# Altium schematic sheet 17. SOC MCU & MAIN GEN IO, OSC.SchDoc: SOC - MCU GENERAL & MAIN GENERAL (part 2 of 2)
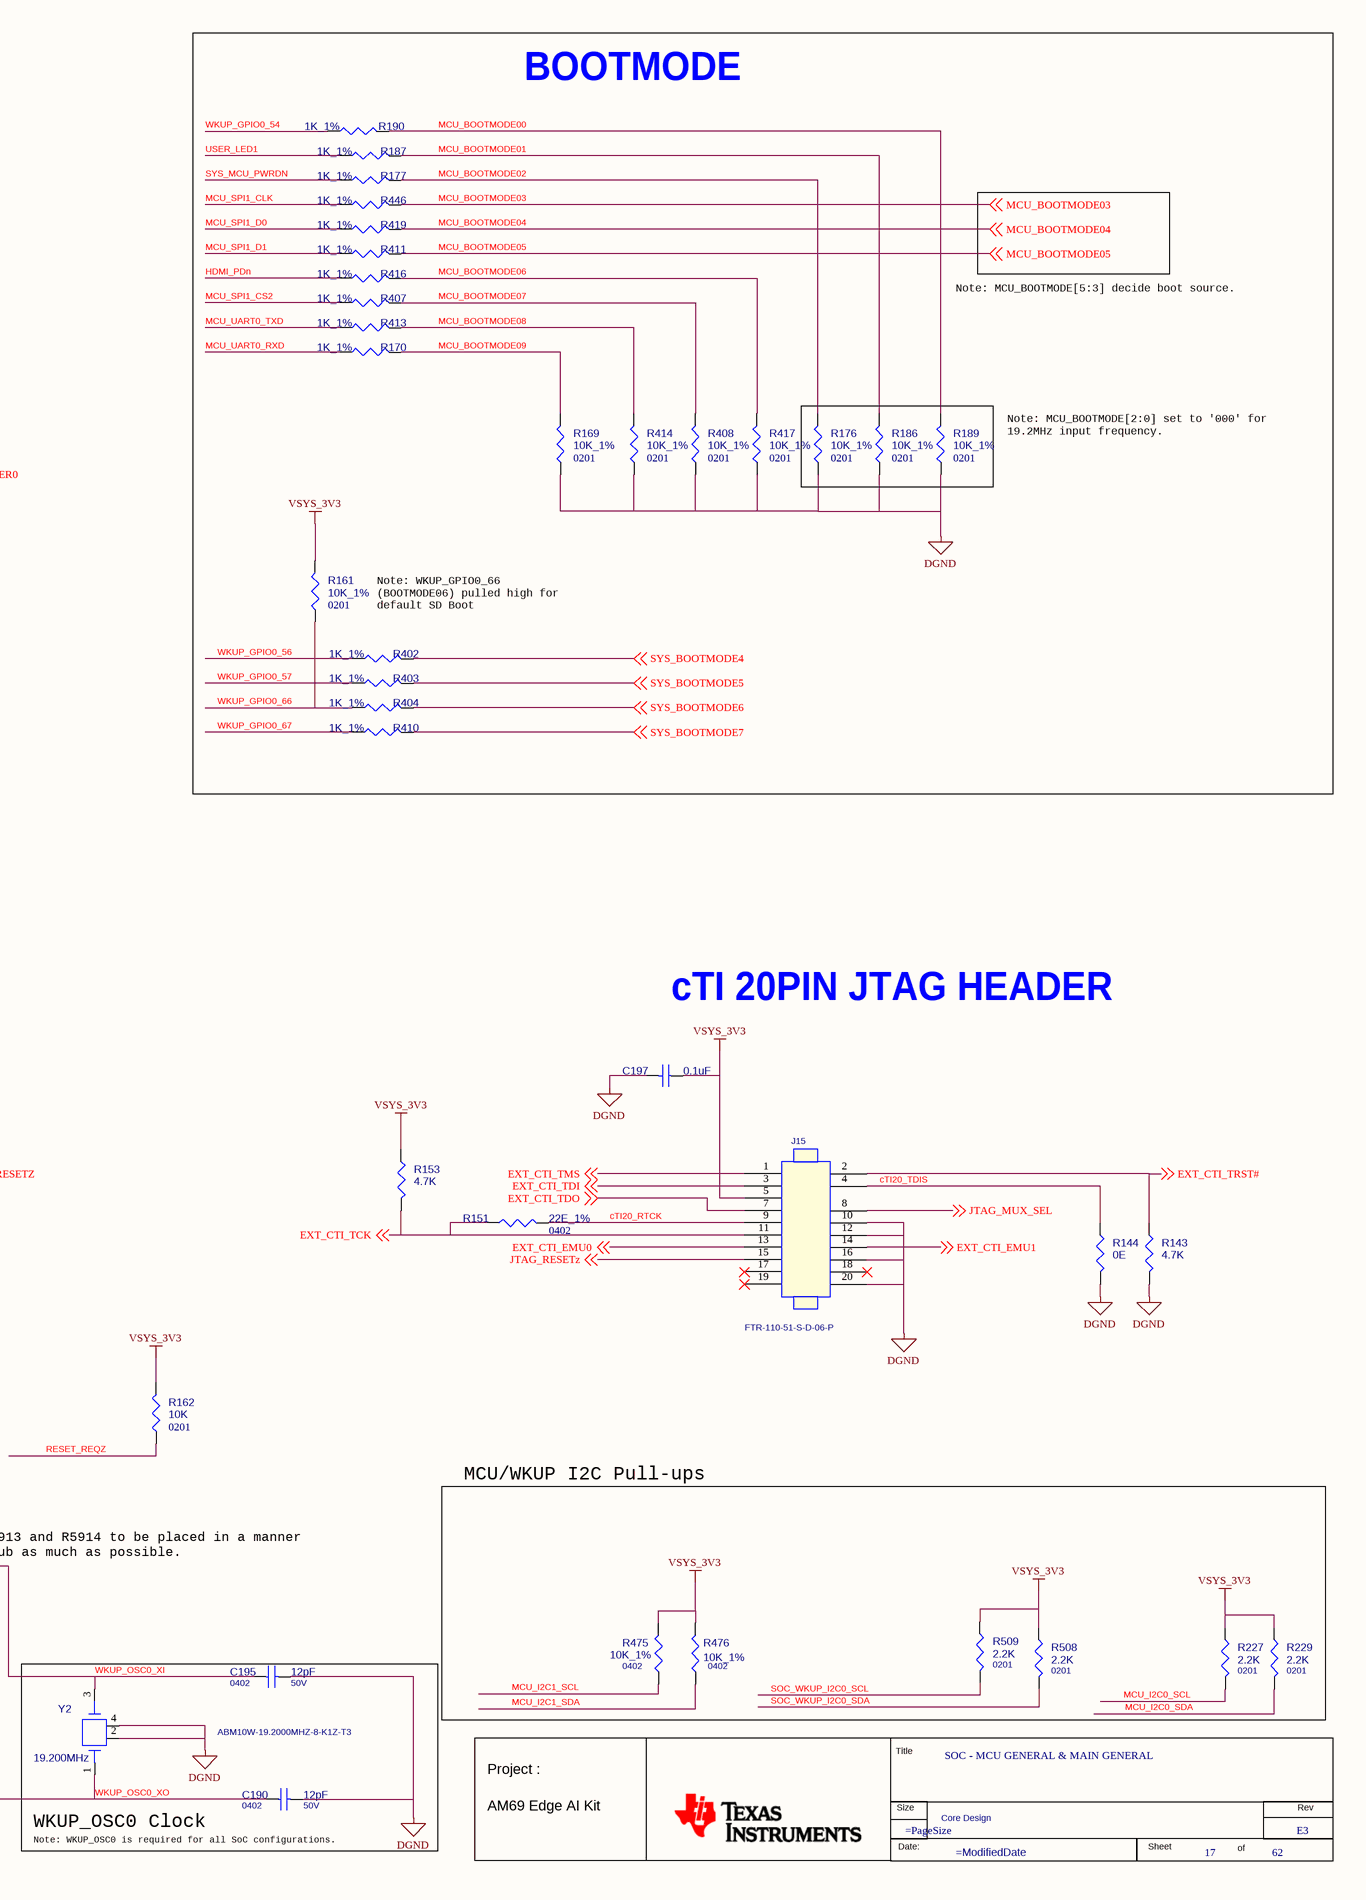
[diagram p2: 17. SOC MCU & MAIN GEN IO, OSC.SchDoc, right]

## Library data of the parts
* = MISTRAL_TITLEBLK_CSIZE_1: Issue: 1.0; Project: PROC154E2(001)_SK_AM69; Name: PROC154E2 001 SK AM69; Page Create Date: March  8, 1995; Page Size: =PageSize; Page Modify Date: =ModifiedDate; Schematic Page Count: 62; Schematic Page Number: 17
C190 = CAP_Dup1: CAP CERAMIC 12pF 50V 5% C0G(NP0) 0402; Part Reference: C190; Mistral Part No: 120015110024-R; Mfr_name: AVX CORPORATION; Mfr_part_number: 04025A120JAT2A; Part_type: CAPACITORS\CERAMIC; Direct Alternate_mfr_name: SAMSUNG; Direct Alternate_mfr_part_number: CL05C120JB5NNNC; Automotive Alternate_mfr_name: TDK; Automotive Alternate_mfr_part_number: CGA2B2C0G1H120J050BA; Project: EPDA_CORE; Customs_HS_Code: 85322990; Custom_Duty: 15%; Wattage: NA; Value: 12pF; Tolerance: 5%; Distributor_name: DIGIKEY; Distributor_part_number: 478-1071-1-ND; Library Ref: CAP; Height: 0.56MM; Datasheet: Y:\MIS_DATABASE\DATASHEETS\CAPACITORS\AVX_MLC.PDF; Crtd /date: MAZHAR/040505; Chkd/date: SHREESHAIL/281105; Footprint Ref: CAP0402_0-75; Weight: 0.65mg; Temperature: -55°C+125°C; MECHANICAL 3D STEP FILE: CAP0402_0-75; Library Path: Y:\MIS_DATABASE\Library\ALTIUM_TOOL\SCHEMATICS_PARTS\MS_DISCRETE_Library.schlib; Footprint Path: Y:\MIS_DATABASE\Library\ALTIUM_TOOL\PCB_FOOTPRINTS\Altium_Footprint_Lib.PcbLib; Manufacturer: AVX CORPORATION; PCB Footprint: CAP0402_0-75
C195 = CAP_Dup1: CAP CERAMIC 12pF 50V 5% C0G(NP0) 0402; Part Reference: C195; Automotive Alternate_mfr_part_number: CGA2B2C0G1H120J050BA; Automotive Alternate_mfr_name: TDK; Direct Alternate_mfr_part_number: CL05C120JB5NNNC; Direct Alternate_mfr_name: SAMSUNG; Mistral Part No: 120015110024-R; Mfr_name: AVX CORPORATION; Mfr_part_number: 04025A120JAT2A; Part_type: CAPACITORS\CERAMIC; Wattage: NA; Project: EPDA_CORE; Customs_HS_Code: 85322990; Custom_Duty: 15%; Value: 12pF; PCB Footprint: CAP0402_0-75; Footprint Path: Y:\MIS_DATABASE\Library\ALTIUM_TOOL\PCB_FOOTPRINTS\Altium_Footprint_Lib.PcbLib; Library Path: Y:\MIS_DATABASE\Library\ALTIUM_TOOL\SCHEMATICS_PARTS\MS_DISCRETE_Library.schlib; MECHANICAL 3D STEP FILE: CAP0402_0-75; Temperature: -55°C+125°C; Weight: 0.65mg; Footprint Ref: CAP0402_0-75; Tolerance: 5%; Distributor_name: DIGIKEY; Distributor_part_number: 478-1071-1-ND; Library Ref: CAP; Height: 0.56MM; Datasheet: Y:\MIS_DATABASE\DATASHEETS\CAPACITORS\AVX_MLC.PDF; Crtd /date: MAZHAR/040505; Chkd/date: SHREESHAIL/281105; Manufacturer: AVX CORPORATION
C197 = CAP_Dup1: CAP CERAMIC 0.1uF 16V 10% X7S AUTO 0201; Part Reference: C197; Part_type: CAPACITORS\CERAMIC; Mfr_part_number: GRT033C71C104KE01D; Mfr_name: MURATA; Mistral Part No: 120021030007-R; Custom_Duty: 15%; Customs_HS_Code: 85322990; Wattage: NA; Project: J7ES_SK_BRD; Value: 0.1uF; MECHANICAL 3D STEP FILE: CAP0201_0-5; Chkd/date: MANIRAJA/110321; Crtd /date: ALVY/110321; Datasheet: Y:\MIS_DATABASE\DATASHEETS\CAPACITORS\GRT033C71C104KE01.PDF; Temperature: -55°C+125°C; Weight: 330mg; Height: 0.33MM; Distributor_part_number: 490-GRT033C71C104KE01DTR-ND; Distributor_name: DIGIKEY; Package: 0201; Voltage: 16V; Tolerance: 10%; PCB Footprint: CAP0201_0-5
C205 = CAP_Dup1: CAP CERAMIC 12pF 50V 5% C0G(NP0) 0402; Part Reference: C205; Automotive Alternate_mfr_part_number: CGA2B2C0G1H120J050BA; Automotive Alternate_mfr_name: TDK; Direct Alternate_mfr_part_number: CL05C120JB5NNNC; Direct Alternate_mfr_name: SAMSUNG; Part_type: CAPACITORS\CERAMIC; Mfr_part_number: 04025A120JAT2A; Mfr_name: AVX CORPORATION; Mistral Part No: 120015110024-R; Wattage: NA; Custom_Duty: 15%; Customs_HS_Code: 85322990; Project: EPDA_CORE; Value: 12pF; Footprint Path: Y:\MIS_DATABASE\Library\ALTIUM_TOOL\PCB_FOOTPRINTS\Altium_Footprint_Lib.PcbLib; Library Path: Y:\MIS_DATABASE\Library\ALTIUM_TOOL\SCHEMATICS_PARTS\MS_DISCRETE_Library.schlib; MECHANICAL 3D STEP FILE: CAP0402_0-75; Temperature: -55°C+125°C; Weight: 0.65mg; Footprint Ref: CAP0402_0-75; Chkd/date: SHREESHAIL/281105; Crtd /date: MAZHAR/040505; Datasheet: Y:\MIS_DATABASE\DATASHEETS\CAPACITORS\AVX_MLC.PDF; Height: 0.56MM; Library Ref: CAP; Distributor_part_number: 478-1071-1-ND; Distributor_name: DIGIKEY; Tolerance: 5%; Manufacturer: AVX CORPORATION; PCB Footprint: CAP0402_0-75
C209 = CAP_Dup1: CAP CERAMIC 12pF 50V 5% C0G(NP0) 0402; Part Reference: C209; Mistral Part No: 120015110024-R; Mfr_name: AVX CORPORATION; Mfr_part_number: 04025A120JAT2A; Part_type: CAPACITORS\CERAMIC; Direct Alternate_mfr_name: SAMSUNG; Direct Alternate_mfr_part_number: CL05C120JB5NNNC; Automotive Alternate_mfr_name: TDK; Automotive Alternate_mfr_part_number: CGA2B2C0G1H120J050BA; Project: EPDA_CORE; Customs_HS_Code: 85322990; Custom_Duty: 15%; Wattage: NA; Value: 12pF; PCB Footprint: CAP0402_0-75; Tolerance: 5%; Distributor_name: DIGIKEY; Distributor_part_number: 478-1071-1-ND; Library Ref: CAP; Height: 0.56MM; Datasheet: Y:\MIS_DATABASE\DATASHEETS\CAPACITORS\AVX_MLC.PDF; Crtd /date: MAZHAR/040505; Chkd/date: SHREESHAIL/281105; Footprint Ref: CAP0402_0-75; Weight: 0.65mg; Temperature: -55°C+125°C; MECHANICAL 3D STEP FILE: CAP0402_0-75; Library Path: Y:\MIS_DATABASE\Library\ALTIUM_TOOL\SCHEMATICS_PARTS\MS_DISCRETE_Library.schlib; Footprint Path: Y:\MIS_DATABASE\Library\ALTIUM_TOOL\PCB_FOOTPRINTS\Altium_Footprint_Lib.PcbLib; Manufacturer: AVX CORPORATION
J15 = HEADER_10X2_FTR-06: CON HDR 2X10 1.27MM PITCH ST SMD; Part Reference: J15; Mistral Part No: 150019010009-R; Mfr_name: SAMTEC; Part_type: CONNECTOR\HEADERS; Project: TI_J7ES_EVM_JTAG; Tolerance: NA; Customs_HS_Code: 85369090; Custom_Duty: 24%; Value: HDR_2X10; Voltage: NA; Wattage: NA; Package: SMD; Distributor_name: DIGIKEY; Distributor_part_number: FTR-110-51-S-D-06-P-ND; Library Ref: HEADER_10X2_FTR-06; Footprint Ref: HDR_2X10_FTR-110-51-D-06_S_S_8-7; Height: 8.67MM; Weight: NA; Temperature: -55°C+125°C; Datasheet: Y:\MIS_DATABASE\DATASHEETS\CONNECTORS\FTR-D-SER.PDF; Crtd /date: MANIRAJA/180119; Chkd/date: MANIRAJA/180119; MECHANICAL 3D STEP FILE: HDR_2X10_FTR-110-51-D-06_S_S_8-7; Library Path: Y:\MIS_DATABASE\Library\ALTIUM_TOOL\SCHEMATICS_PARTS\MS_CONNECTOR_Library.schlib; Footprint Path: Y:\MIS_DATABASE\Library\ALTIUM_TOOL\PCB_FOOTPRINTS\Altium_Footprint_Lib.PcbLib; PCB Footprint: HDR_2X10_FTR-110-51-D-06_S_S_8-7
R143 = RESISTOR_Dup2: RES 4.7K 1/20W 5% 0201; Part Reference: R143; Part_type: RESISTORS\FIXED; Mfr_part_number: ERJ-1GNJ472C; Mfr_name: PANASONIC-ECG; Mistral Part No: 110010070061-R; Custom_Duty: 15%; Customs_HS_Code: 85332119; Voltage: NA; Project: CUSTOM DCA1000; Value: 4.7K; Footprint Path: Y:\MIS_DATABASE\Library\ALTIUM_TOOL\PCB_FOOTPRINTS\Altium_Footprint_Lib.PcbLib; Library Path: Y:\MIS_DATABASE\Library\ALTIUM_TOOL\SCHEMATICS_PARTS\MS_DISCRETE_Library.schlib; MECHANICAL 3D STEP FILE: RES0201_0-5; Chkd/date: MANIRAJA/170420; Crtd /date: ALVY/170420; Datasheet: Y:\MIS_DATABASE\DATASHEETS\RESISTORS\PAN-ERJSER_NOV17.PDF; Temperature: -55°C+125°C; Weight: 0.15mg; Height: 0.26MM; Footprint Ref: RES0201_0-5; Library Ref: RESISTOR; Distributor_part_number: P4.7AECT-ND; Distributor_name: DIGIKEY; Package: 0201; Wattage: 1/20W; Tolerance: 5%; PCB Footprint: RES0201_0-5
R144 = RESISTOR_Dup2: RES 0E 1/10W JUMPER 0402; Part Reference: R144; Mistral Part No: 110018030052-R; Mfr_name: PANASONIC-ECG; Mfr_part_number: ERJ-2GE0R00X; Part_type: RESISTORS\FIXED; Project: AEGIS POM; Tolerance: NA; Customs_HS_Code: 85332119; Custom_Duty: 15%; Value: 0E; MECHANICAL 3D STEP FILE: RES0402_0-5; Voltage: NA; Wattage: 1/10W; Package: 0402; Distributor_name: DIGIKEY; Distributor_part_number: P0.0JCT-ND; Height: 0.40MM; Weight: 0.8mg; Temperature: -55°C+155°C; Datasheet: Y:\MIS_DATABASE\DATASHEETS\RESISTORS\PAN-ERJSER_NOV17.PDF; Crtd /date: NAVEED/201014; Chkd/date: VASANTHA/061216; Library Ref: RESISTOR; Footprint Ref: RES0402_0-5; Library Path: Y:\MIS_DATABASE\Library\ALTIUM_TOOL\SCHEMATICS_PARTS\MS_DISCRETE_Library.schlib; Footprint Path: Y:\MIS_DATABASE\Library\ALTIUM_TOOL\PCB_FOOTPRINTS\Altium_Footprint_Lib.PcbLib; PCB Footprint: RES0402_0-5
R151 = RESISTOR_Dup2: RES 22E 1/16W 1% 0402; Part Reference: R151; Mistral Part No: 110009090004-R; Mfr_name: YAGEO AMERICA; Mfr_part_number: RC0402FR-0722RL; Part_type: RESISTORS\FIXED; Cust_part_number: 4700-80047E; Project: VMEFMCD; Voltage: NA; Customs_HS_Code: 85332119; Custom_Duty: 15%; Value: 22E_1%; Footprint Path: Y:\MIS_DATABASE\Library\ALTIUM_TOOL\PCB_FOOTPRINTS\Altium_Footprint_Lib.PcbLib; Library Path: Y:\MIS_DATABASE\Library\ALTIUM_TOOL\SCHEMATICS_PARTS\MS_DISCRETE_Library.schlib; MECHANICAL 3D STEP FILE: RES0402_0-5; Footprint Ref: RES0402_0-5; Tolerance: 1%; Wattage: 1/16W; Distributor_name: DIGIKEY; Distributor_part_number: 311-22.0LRCT-ND; Library Ref: RESISTOR; Height: 0.40MM; Weight: 0.65mg; Temperature: -55°C+155°C; Datasheet: Y:\MIS_DATABASE\DATASHEETS\RESISTORS\RCXXXXL-SER_MAR18.PDF; Crtd /date: MAZHAR/090909; Chkd/date: SUHAS/290910; PCB Footprint: RES0402_0-5
R153 = RESISTOR_Dup2: RES 4.7K 1/20W 5% 0201; Part Reference: R153; Mistral Part No: 110010070061-R; Mfr_name: PANASONIC-ECG; Mfr_part_number: ERJ-1GNJ472C; Part_type: RESISTORS\FIXED; Project: CUSTOM DCA1000; Voltage: NA; Customs_HS_Code: 85332119; Custom_Duty: 15%; Value: 4.7K; Tolerance: 5%; Wattage: 1/20W; Package: 0201; Distributor_name: DIGIKEY; Distributor_part_number: P4.7AECT-ND; Library Ref: RESISTOR; Footprint Ref: RES0201_0-5; Height: 0.26MM; Weight: 0.15mg; Temperature: -55°C+125°C; Datasheet: Y:\MIS_DATABASE\DATASHEETS\RESISTORS\PAN-ERJSER_NOV17.PDF; Crtd /date: ALVY/170420; Chkd/date: MANIRAJA/170420; MECHANICAL 3D STEP FILE: RES0201_0-5; Library Path: Y:\MIS_DATABASE\Library\ALTIUM_TOOL\SCHEMATICS_PARTS\MS_DISCRETE_Library.schlib; Footprint Path: Y:\MIS_DATABASE\Library\ALTIUM_TOOL\PCB_FOOTPRINTS\Altium_Footprint_Lib.PcbLib; PCB Footprint: RES0201_0-5
R155 = RESISTOR_Dup2: RES 0E 1/10W JUMPER 0402; Part Reference: R155; Manufacturer: PANASONIC-ECG; Part_type: RESISTORS\FIXED; Mfr_part_number: ERJ-2GE0R00X; Mistral Part No: 110018030052-R; IBISSP_MODLES: VALUE REPEATING 2 TIME; Custom_Duty: 15%; Customs_HS_Code: 85332119; Voltage: NA; Project: AEGIS POM; Value: 0E; Footprint Path: Y:\MIS_DATABASE\Library\ALTIUM_TOOL\PCB_FOOTPRINTS\Altium_Footprint_Lib.PcbLib; MECHANICAL 3D STEP FILE: RES0402_0-5; Chkd/date: VASANTHA/061216; Crtd /date: NAVEED/201014; Datasheet: Y:\MIS_DATABASE\DATASHEETS\RESISTORS\PAN-ERJSER_NOV17.PDF; Temperature: -55°C+155°C; Weight: 0.8mg; Height: 0.40MM; Library Ref: RESISTOR; Distributor_part_number: P0.0JCT-ND; Distributor_name: DIGIKEY; Wattage: 1/10W; Tolerance: NA; Mfr_name: PANASONIC-ECG; Footprint Ref: RES0402_0-5; Library Path: Y:\MIS_DATABASE\Library\ALTIUM_TOOL\SCHEMATICS_PARTS\MS_DISCRETE_Library.schlib; PCB Footprint: RES0402_0-5
R157 = RESISTOR_Dup2: RES 0E 1/10W JUMPER 0402; Part Reference: R157; Manufacturer: PANASONIC-ECG; Part_type: RESISTORS\FIXED; Mfr_part_number: ERJ-2GE0R00X; Mistral Part No: 110018030052-R; IBISSP_MODLES: VALUE REPEATING 2 TIME; Custom_Duty: 15%; Customs_HS_Code: 85332119; Voltage: NA; Project: AEGIS POM; Value: 0E; PCB Footprint: RES0402_0-5; Footprint Path: Y:\MIS_DATABASE\Library\ALTIUM_TOOL\PCB_FOOTPRINTS\Altium_Footprint_Lib.PcbLib; MECHANICAL 3D STEP FILE: RES0402_0-5; Chkd/date: VASANTHA/061216; Crtd /date: NAVEED/201014; Datasheet: Y:\MIS_DATABASE\DATASHEETS\RESISTORS\PAN-ERJSER_NOV17.PDF; Temperature: -55°C+155°C; Weight: 0.8mg; Height: 0.40MM; Library Ref: RESISTOR; Distributor_part_number: P0.0JCT-ND; Distributor_name: DIGIKEY; Wattage: 1/10W; Tolerance: NA; Mfr_name: PANASONIC-ECG; Footprint Ref: RES0402_0-5; Library Path: Y:\MIS_DATABASE\Library\ALTIUM_TOOL\SCHEMATICS_PARTS\MS_DISCRETE_Library.schlib
R161 = RESISTOR_Dup2: RES 10K 1/20W 1% 0201; Part Reference: R161; Manufacturer: SAMSUNG; Part_type: RESISTORS\FIXED; Mfr_part_number: RC0603F103CS; Mistral Part No: 110011040018-R; Custom_Duty: 15%; Customs_HS_Code: 85332119; Voltage: NA; Project: BRUKER_SD820_COMMONDO; Value: 10K_1%; Footprint Path: Y:\MIS_DATABASE\Library\ALTIUM_TOOL\PCB_FOOTPRINTS\Altium_Footprint_Lib.PcbLib; Library Path: Y:\MIS_DATABASE\Library\ALTIUM_TOOL\SCHEMATICS_PARTS\MS_DISCRETE_Library.schlib; Footprint Ref: RES0201_0-5; Library Ref: RESISTOR; MECHANICAL 3D STEP FILE: RES0201_0-5; Chkd/date: MANIRAJA/080519; Crtd /date: ALVY/080519; Datasheet: Y:\MIS_DATABASE\DATASHEETS\RESISTORS\SAMSUNG_RC-SER.PDF; Temperature: -55°C+125°C; Weight: 0.15mg; Height: 0.26MM; Distributor_part_number: 1276-3670-1-ND; Distributor_name: DIGIKEY; Wattage: 1/20W; Tolerance: 1%; Mfr_name: SAMSUNG; PCB Footprint: RES0201_0-5
R162 = RESISTOR_Dup2: RES 10K 1/20W 5% 0201; Part Reference: R162; Part_type: RESISTORS\FIXED; Mfr_part_number: RC0201JR-0710KL; Mfr_name: YAGEO AMERICA; Mistral Part No: 110010070051-R; Custom_Duty: 15%; Customs_HS_Code: 85332119; Voltage: NA; Project: GOLDEN-I LITE; Value: 10K; Footprint Path: Y:\MIS_DATABASE\Library\ALTIUM_TOOL\PCB_FOOTPRINTS\Altium_Footprint_Lib.PcbLib; Library Path: Y:\MIS_DATABASE\Library\ALTIUM_TOOL\SCHEMATICS_PARTS\MS_DISCRETE_Library.schlib; MECHANICAL 3D STEP FILE: RES0201_0-5; Footprint Ref: RES0201_0-5; Library Ref: RESISTOR; Chkd/date: MANIRAJA/050517; Crtd /date: MANIRAJA/050517; Datasheet: Y:\MIS_DATABASE\DATASHEETS\RESISTORS\RCXXXXL-SER_MAR18.PDF; Temperature: -55°C+125°C; Weight: 0.17mg; Height: 0.26MM; Distributor_part_number: 311-10KNCT-ND; Distributor_name: DIGIKEY; Wattage: 1/20W; Tolerance: 5%; PCB Footprint: RES0201_0-5
R169 = RESISTOR_Dup2: RES 10K 1/20W 1% 0201; Part Reference: R169; Manufacturer: SAMSUNG; Part_type: RESISTORS\FIXED; Mfr_part_number: RC0603F103CS; Mistral Part No: 110011040018-R; Custom_Duty: 15%; Customs_HS_Code: 85332119; Voltage: NA; Project: BRUKER_SD820_COMMONDO; Value: 10K_1%; Footprint Path: Y:\MIS_DATABASE\Library\ALTIUM_TOOL\PCB_FOOTPRINTS\Altium_Footprint_Lib.PcbLib; Library Path: Y:\MIS_DATABASE\Library\ALTIUM_TOOL\SCHEMATICS_PARTS\MS_DISCRETE_Library.schlib; Footprint Ref: RES0201_0-5; Library Ref: RESISTOR; MECHANICAL 3D STEP FILE: RES0201_0-5; Chkd/date: MANIRAJA/080519; Crtd /date: ALVY/080519; Datasheet: Y:\MIS_DATABASE\DATASHEETS\RESISTORS\SAMSUNG_RC-SER.PDF; Temperature: -55°C+125°C; Weight: 0.15mg; Height: 0.26MM; Distributor_part_number: 1276-3670-1-ND; Distributor_name: DIGIKEY; Wattage: 1/20W; Tolerance: 1%; Mfr_name: SAMSUNG; PCB Footprint: RES0201_0-5
R170 = RESISTOR_Dup1: RES 1K 1/20W 1% 0201; Part Reference: R170; Manufacturer: KOA SPEER; Mistral Part No: 110015080014-R; Mfr_part_number: RK73H1HTTC1001F; Part_type: RESISTORS\FIXED; Voltage: NA; Project: HMC; Customs_HS_Code: 85332119; Custom_Duty: 15%; Value: 1K_1%; Footprint Path: Y:\MIS_DATABASE\Library\ALTIUM_TOOL\PCB_FOOTPRINTS\Altium_Footprint_Lib.PcbLib; Library Path: Y:\MIS_DATABASE\Library\ALTIUM_TOOL\SCHEMATICS_PARTS\MS_DISCRETE_Library.schlib; MECHANICAL 3D STEP FILE: RES0201_0-5; Footprint Ref: RES0201_0-5; Mfr_name: KOA SPEER; Tolerance: 1%; Wattage: 1/20W; Package: 0201; Distributor_name: MOUSER; Distributor_part_number: 660-RK73H1HTTC1001F; Height: 0.26MM; Weight: 0.17mg; Temperature: -55°C+155°C; Datasheet: Y:\MIS_DATABASE\DATASHEETS\RESISTORS\RK73H-SER.PDF; Crtd /date: MAZHAR/100511; Chkd/date: RAGESH/120511; Library Ref: RESISTOR; PCB Footprint: RES0201_0-5
R175 = RESISTOR_Dup2: RES 2.2K 1/20W 5% 0201; Part Reference: R175; Manufacturer: YAGEO AMERICA; Mistral Part No: 110009030427-R; Mfr_part_number: RC0201JR-072K2L; Part_type: RESISTORS\FIXED; Project: GOLDEN-I LITE; Voltage: NA; Customs_HS_Code: 85332119; Custom_Duty: 15%; Value: 2.2K; Footprint Path: Y:\MIS_DATABASE\Library\ALTIUM_TOOL\PCB_FOOTPRINTS\Altium_Footprint_Lib.PcbLib; Library Path: Y:\MIS_DATABASE\Library\ALTIUM_TOOL\SCHEMATICS_PARTS\MS_DISCRETE_Library.schlib; Footprint Ref: RES0201_0-5; Mfr_name: YAGEO AMERICA; Tolerance: 5%; Wattage: 1/20W; Distributor_name: DIGIKEY; Distributor_part_number: 311-2.2KNCT-ND; Library Ref: RESISTOR; Height: 0.26MM; Weight: 0.17mg; Temperature: -55°C+125°C; Datasheet: Y:\MIS_DATABASE\DATASHEETS\RESISTORS\RCXXXXL-SER_MAR18.PDF; Crtd /date: MANIRAJA/050517; Chkd/date: MANIRAJA/050517; MECHANICAL 3D STEP FILE: RES0201_0-5; PCB Footprint: RES0201_0-5
R176 = RESISTOR_Dup2: RES 10K 1/20W 1% 0201; Part Reference: R176; Manufacturer: SAMSUNG; Part_type: RESISTORS\FIXED; Mfr_part_number: RC0603F103CS; Mistral Part No: 110011040018-R; Custom_Duty: 15%; Customs_HS_Code: 85332119; Voltage: NA; Project: BRUKER_SD820_COMMONDO; Value: 10K_1%; Footprint Path: Y:\MIS_DATABASE\Library\ALTIUM_TOOL\PCB_FOOTPRINTS\Altium_Footprint_Lib.PcbLib; Library Path: Y:\MIS_DATABASE\Library\ALTIUM_TOOL\SCHEMATICS_PARTS\MS_DISCRETE_Library.schlib; Footprint Ref: RES0201_0-5; Library Ref: RESISTOR; MECHANICAL 3D STEP FILE: RES0201_0-5; Chkd/date: MANIRAJA/080519; Crtd /date: ALVY/080519; Datasheet: Y:\MIS_DATABASE\DATASHEETS\RESISTORS\SAMSUNG_RC-SER.PDF; Temperature: -55°C+125°C; Weight: 0.15mg; Height: 0.26MM; Distributor_part_number: 1276-3670-1-ND; Distributor_name: DIGIKEY; Wattage: 1/20W; Tolerance: 1%; Mfr_name: SAMSUNG; PCB Footprint: RES0201_0-5
R177 = RESISTOR_Dup1: RES 1K 1/20W 1% 0201; Part Reference: R177; Part_type: RESISTORS\FIXED; Mfr_part_number: RK73H1HTTC1001F; Mfr_name: KOA SPEER; Mistral Part No: 110015080014-R; Custom_Duty: 15%; Customs_HS_Code: 85332119; Project: HMC; Voltage: NA; Value: 1K_1%; PCB Footprint: RES0201_0-5; Library Ref: RESISTOR; Chkd/date: RAGESH/120511; Crtd /date: MAZHAR/100511; Datasheet: Y:\MIS_DATABASE\DATASHEETS\RESISTORS\RK73H-SER.PDF; Temperature: -55°C+155°C; Weight: 0.17mg; Height: 0.26MM; Distributor_part_number: 660-RK73H1HTTC1001F; Distributor_name: MOUSER; Package: 0201; Wattage: 1/20W; Tolerance: 1%; Footprint Ref: RES0201_0-5; MECHANICAL 3D STEP FILE: RES0201_0-5; Library Path: Y:\MIS_DATABASE\Library\ALTIUM_TOOL\SCHEMATICS_PARTS\MS_DISCRETE_Library.schlib; Footprint Path: Y:\MIS_DATABASE\Library\ALTIUM_TOOL\PCB_FOOTPRINTS\Altium_Footprint_Lib.PcbLib; Manufacturer: KOA SPEER
R186 = RESISTOR_Dup2: RES 10K 1/20W 1% 0201; Part Reference: R186; Manufacturer: SAMSUNG; Part_type: RESISTORS\FIXED; Mfr_part_number: RC0603F103CS; Mistral Part No: 110011040018-R; Custom_Duty: 15%; Customs_HS_Code: 85332119; Voltage: NA; Project: BRUKER_SD820_COMMONDO; Value: 10K_1%; Footprint Path: Y:\MIS_DATABASE\Library\ALTIUM_TOOL\PCB_FOOTPRINTS\Altium_Footprint_Lib.PcbLib; Library Path: Y:\MIS_DATABASE\Library\ALTIUM_TOOL\SCHEMATICS_PARTS\MS_DISCRETE_Library.schlib; Footprint Ref: RES0201_0-5; Library Ref: RESISTOR; MECHANICAL 3D STEP FILE: RES0201_0-5; Chkd/date: MANIRAJA/080519; Crtd /date: ALVY/080519; Datasheet: Y:\MIS_DATABASE\DATASHEETS\RESISTORS\SAMSUNG_RC-SER.PDF; Temperature: -55°C+125°C; Weight: 0.15mg; Height: 0.26MM; Distributor_part_number: 1276-3670-1-ND; Distributor_name: DIGIKEY; Wattage: 1/20W; Tolerance: 1%; Mfr_name: SAMSUNG; PCB Footprint: RES0201_0-5
R187 = RESISTOR_Dup1: RES 1K 1/20W 1% 0201; Part Reference: R187; Manufacturer: KOA SPEER; Mistral Part No: 110015080014-R; Mfr_part_number: RK73H1HTTC1001F; Part_type: RESISTORS\FIXED; Voltage: NA; Project: HMC; Customs_HS_Code: 85332119; Custom_Duty: 15%; Value: 1K_1%; PCB Footprint: RES0201_0-5; Footprint Path: Y:\MIS_DATABASE\Library\ALTIUM_TOOL\PCB_FOOTPRINTS\Altium_Footprint_Lib.PcbLib; Library Path: Y:\MIS_DATABASE\Library\ALTIUM_TOOL\SCHEMATICS_PARTS\MS_DISCRETE_Library.schlib; MECHANICAL 3D STEP FILE: RES0201_0-5; Footprint Ref: RES0201_0-5; Mfr_name: KOA SPEER; Tolerance: 1%; Wattage: 1/20W; Package: 0201; Distributor_name: MOUSER; Distributor_part_number: 660-RK73H1HTTC1001F; Height: 0.26MM; Weight: 0.17mg; Temperature: -55°C+155°C; Datasheet: Y:\MIS_DATABASE\DATASHEETS\RESISTORS\RK73H-SER.PDF; Crtd /date: MAZHAR/100511; Chkd/date: RAGESH/120511; Library Ref: RESISTOR
R189 = RESISTOR_Dup2: RES 10K 1/20W 1% 0201; Part Reference: R189; Mistral Part No: 110011040018-R; Mfr_name: SAMSUNG; Mfr_part_number: RC0603F103CS; Part_type: RESISTORS\FIXED; Project: BRUKER_SD820_COMMONDO; Voltage: NA; Customs_HS_Code: 85332119; Custom_Duty: 15%; Value: 10K_1%; Tolerance: 1%; Wattage: 1/20W; Distributor_name: DIGIKEY; Distributor_part_number: 1276-3670-1-ND; Height: 0.26MM; Weight: 0.15mg; Temperature: -55°C+125°C; Datasheet: Y:\MIS_DATABASE\DATASHEETS\RESISTORS\SAMSUNG_RC-SER.PDF; Crtd /date: ALVY/080519; Chkd/date: MANIRAJA/080519; MECHANICAL 3D STEP FILE: RES0201_0-5; Library Ref: RESISTOR; Footprint Ref: RES0201_0-5; Library Path: Y:\MIS_DATABASE\Library\ALTIUM_TOOL\SCHEMATICS_PARTS\MS_DISCRETE_Library.schlib; Footprint Path: Y:\MIS_DATABASE\Library\ALTIUM_TOOL\PCB_FOOTPRINTS\Altium_Footprint_Lib.PcbLib; Manufacturer: SAMSUNG; PCB Footprint: RES0201_0-5
R190 = RESISTOR_Dup1: RES 1K 1/20W 1% 0201; Part Reference: R190; Manufacturer: KOA SPEER; Mistral Part No: 110015080014-R; Mfr_part_number: RK73H1HTTC1001F; Part_type: RESISTORS\FIXED; Voltage: NA; Project: HMC; Customs_HS_Code: 85332119; Custom_Duty: 15%; Value: 1K_1%; PCB Footprint: RES0201_0-5; Footprint Path: Y:\MIS_DATABASE\Library\ALTIUM_TOOL\PCB_FOOTPRINTS\Altium_Footprint_Lib.PcbLib; Library Path: Y:\MIS_DATABASE\Library\ALTIUM_TOOL\SCHEMATICS_PARTS\MS_DISCRETE_Library.schlib; MECHANICAL 3D STEP FILE: RES0201_0-5; Footprint Ref: RES0201_0-5; Mfr_name: KOA SPEER; Tolerance: 1%; Wattage: 1/20W; Package: 0201; Distributor_name: MOUSER; Distributor_part_number: 660-RK73H1HTTC1001F; Height: 0.26MM; Weight: 0.17mg; Temperature: -55°C+155°C; Datasheet: Y:\MIS_DATABASE\DATASHEETS\RESISTORS\RK73H-SER.PDF; Crtd /date: MAZHAR/100511; Chkd/date: RAGESH/120511; Library Ref: RESISTOR
R227 = RESISTOR_Dup2: RES 2.2K 1/20W 5% 0201; Part Reference: R227; Manufacturer: YAGEO AMERICA; Part_type: RESISTORS\FIXED; Mfr_part_number: RC0201JR-072K2L; Mistral Part No: 110009030427-R; Custom_Duty: 15%; Customs_HS_Code: 85332119; Voltage: NA; Project: GOLDEN-I LITE; Value: 2.2K; PCB Footprint: RES0201_0-5; MECHANICAL 3D STEP FILE: RES0201_0-5; Chkd/date: MANIRAJA/050517; Crtd /date: MANIRAJA/050517; Datasheet: Y:\MIS_DATABASE\DATASHEETS\RESISTORS\RCXXXXL-SER_MAR18.PDF; Temperature: -55°C+125°C; Weight: 0.17mg; Height: 0.26MM; Library Ref: RESISTOR; Distributor_part_number: 311-2.2KNCT-ND; Distributor_name: DIGIKEY; Wattage: 1/20W; Tolerance: 5%; Mfr_name: YAGEO AMERICA; Footprint Ref: RES0201_0-5; Library Path: Y:\MIS_DATABASE\Library\ALTIUM_TOOL\SCHEMATICS_PARTS\MS_DISCRETE_Library.schlib; Footprint Path: Y:\MIS_DATABASE\Library\ALTIUM_TOOL\PCB_FOOTPRINTS\Altium_Footprint_Lib.PcbLib
R229 = RESISTOR_Dup2: RES 2.2K 1/20W 5% 0201; Part Reference: R229; Manufacturer: YAGEO AMERICA; Part_type: RESISTORS\FIXED; Mfr_part_number: RC0201JR-072K2L; Mistral Part No: 110009030427-R; Custom_Duty: 15%; Customs_HS_Code: 85332119; Voltage: NA; Project: GOLDEN-I LITE; Value: 2.2K; PCB Footprint: RES0201_0-5; MECHANICAL 3D STEP FILE: RES0201_0-5; Chkd/date: MANIRAJA/050517; Crtd /date: MANIRAJA/050517; Datasheet: Y:\MIS_DATABASE\DATASHEETS\RESISTORS\RCXXXXL-SER_MAR18.PDF; Temperature: -55°C+125°C; Weight: 0.17mg; Height: 0.26MM; Library Ref: RESISTOR; Distributor_part_number: 311-2.2KNCT-ND; Distributor_name: DIGIKEY; Wattage: 1/20W; Tolerance: 5%; Mfr_name: YAGEO AMERICA; Footprint Ref: RES0201_0-5; Library Path: Y:\MIS_DATABASE\Library\ALTIUM_TOOL\SCHEMATICS_PARTS\MS_DISCRETE_Library.schlib; Footprint Path: Y:\MIS_DATABASE\Library\ALTIUM_TOOL\PCB_FOOTPRINTS\Altium_Footprint_Lib.PcbLib
R292 = RESISTOR_Dup2: RES 0E 1/10W JUMPER 0402; Part Reference: R292; Mistral Part No: 110018030052-R; Mfr_name: PANASONIC-ECG; Mfr_part_number: ERJ-2GE0R00X; Part_type: RESISTORS\FIXED; Project: AEGIS POM; Tolerance: NA; Customs_HS_Code: 85332119; Custom_Duty: 15%; IBISSP_MODLES: VALUE REPEATING 2 TIME; Value: 0E; Library Path: Y:\MIS_DATABASE\Library\ALTIUM_TOOL\SCHEMATICS_PARTS\MS_DISCRETE_Library.schlib; Footprint Ref: RES0402_0-5; Voltage: NA; Wattage: 1/10W; Package: 0402; Distributor_name: DIGIKEY; Distributor_part_number: P0.0JCT-ND; Library Ref: RESISTOR; Height: 0.40MM; Weight: 0.8mg; Temperature: -55°C+155°C; Datasheet: Y:\MIS_DATABASE\DATASHEETS\RESISTORS\PAN-ERJSER_NOV17.PDF; Crtd /date: NAVEED/201014; Chkd/date: VASANTHA/061216; MECHANICAL 3D STEP FILE: RES0402_0-5; Footprint Path: Y:\MIS_DATABASE\Library\ALTIUM_TOOL\PCB_FOOTPRINTS\Altium_Footprint_Lib.PcbLib; Manufacturer: PANASONIC-ECG; PCB Footprint: RES0402_0-5
R309 = RESISTOR_Dup2: RES 10K 1/16W 1% 0402; Part Reference: R309; Manufacturer: YAGEO AMERICA; Part_type: RESISTORS\FIXED; Mfr_part_number: RC0402FR-0710KL; Mistral Part No: 110015090015-R; Custom_Duty: 15%; Customs_HS_Code: 85332119; Voltage: NA; Project: VOCERA; Value: 10K_1%; Footprint Path: Y:\MIS_DATABASE\Library\ALTIUM_TOOL\PCB_FOOTPRINTS\Altium_Footprint_Lib.PcbLib; Library Path: Y:\MIS_DATABASE\Library\ALTIUM_TOOL\SCHEMATICS_PARTS\MS_DISCRETE_Library.schlib; MECHANICAL 3D STEP FILE: RES0402_0-5; Chkd/date: VASANTHA/201216; Crtd /date: GEETHA/290506; Datasheet: Y:\MIS_DATABASE\DATASHEETS\RESISTORS\RCXXXXL-SER_MAR18.PDF; Temperature: -55°C+155°C; Weight: 0.65mg; Height: 0.40MM; Library Ref: RESISTOR; Distributor_part_number: 311-10.0KLRTR-ND; Distributor_name: DIGIKEY; Package: 0402; Wattage: 1/16W; Tolerance: 1%; Mfr_name: YAGEO AMERICA; Footprint Ref: RES0402_0-5; PCB Footprint: RES0402_0-5
R401 = RESISTOR_Dup2: RES 0E 1/10W JUMPER 0402; Part Reference: R401; Mistral Part No: 110018030052-R; Mfr_name: PANASONIC-ECG; Mfr_part_number: ERJ-2GE0R00X; Part_type: RESISTORS\FIXED; Project: AEGIS POM; Tolerance: NA; Customs_HS_Code: 85332119; Custom_Duty: 15%; IBISSP_MODLES: VALUE REPEATING 2 TIME; Value: 0E; Library Path: Y:\MIS_DATABASE\Library\ALTIUM_TOOL\SCHEMATICS_PARTS\MS_DISCRETE_Library.schlib; Footprint Ref: RES0402_0-5; Voltage: NA; Wattage: 1/10W; Package: 0402; Distributor_name: DIGIKEY; Distributor_part_number: P0.0JCT-ND; Library Ref: RESISTOR; Height: 0.40MM; Weight: 0.8mg; Temperature: -55°C+155°C; Datasheet: Y:\MIS_DATABASE\DATASHEETS\RESISTORS\PAN-ERJSER_NOV17.PDF; Crtd /date: NAVEED/201014; Chkd/date: VASANTHA/061216; MECHANICAL 3D STEP FILE: RES0402_0-5; Footprint Path: Y:\MIS_DATABASE\Library\ALTIUM_TOOL\PCB_FOOTPRINTS\Altium_Footprint_Lib.PcbLib; Manufacturer: PANASONIC-ECG; PCB Footprint: RES0402_0-5
R402 = RESISTOR_Dup1: RES 1K 1/20W 1% 0201; Part Reference: R402; Manufacturer: KOA SPEER; Mistral Part No: 110015080014-R; Mfr_part_number: RK73H1HTTC1001F; Part_type: RESISTORS\FIXED; Voltage: NA; Project: HMC; Customs_HS_Code: 85332119; Custom_Duty: 15%; Value: 1K_1%; PCB Footprint: RES0201_0-5; Footprint Path: Y:\MIS_DATABASE\Library\ALTIUM_TOOL\PCB_FOOTPRINTS\Altium_Footprint_Lib.PcbLib; Library Path: Y:\MIS_DATABASE\Library\ALTIUM_TOOL\SCHEMATICS_PARTS\MS_DISCRETE_Library.schlib; MECHANICAL 3D STEP FILE: RES0201_0-5; Footprint Ref: RES0201_0-5; Mfr_name: KOA SPEER; Tolerance: 1%; Wattage: 1/20W; Package: 0201; Distributor_name: MOUSER; Distributor_part_number: 660-RK73H1HTTC1001F; Height: 0.26MM; Weight: 0.17mg; Temperature: -55°C+155°C; Datasheet: Y:\MIS_DATABASE\DATASHEETS\RESISTORS\RK73H-SER.PDF; Crtd /date: MAZHAR/100511; Chkd/date: RAGESH/120511; Library Ref: RESISTOR
R403 = RESISTOR_Dup1: RES 1K 1/20W 1% 0201; Part Reference: R403; Manufacturer: KOA SPEER; Mistral Part No: 110015080014-R; Mfr_part_number: RK73H1HTTC1001F; Part_type: RESISTORS\FIXED; Voltage: NA; Project: HMC; Customs_HS_Code: 85332119; Custom_Duty: 15%; Value: 1K_1%; PCB Footprint: RES0201_0-5; Footprint Path: Y:\MIS_DATABASE\Library\ALTIUM_TOOL\PCB_FOOTPRINTS\Altium_Footprint_Lib.PcbLib; Library Path: Y:\MIS_DATABASE\Library\ALTIUM_TOOL\SCHEMATICS_PARTS\MS_DISCRETE_Library.schlib; MECHANICAL 3D STEP FILE: RES0201_0-5; Footprint Ref: RES0201_0-5; Mfr_name: KOA SPEER; Tolerance: 1%; Wattage: 1/20W; Package: 0201; Distributor_name: MOUSER; Distributor_part_number: 660-RK73H1HTTC1001F; Height: 0.26MM; Weight: 0.17mg; Temperature: -55°C+155°C; Datasheet: Y:\MIS_DATABASE\DATASHEETS\RESISTORS\RK73H-SER.PDF; Crtd /date: MAZHAR/100511; Chkd/date: RAGESH/120511; Library Ref: RESISTOR
R404 = RESISTOR_Dup1: RES 1K 1/20W 1% 0201; Part Reference: R404; Manufacturer: KOA SPEER; Mistral Part No: 110015080014-R; Mfr_part_number: RK73H1HTTC1001F; Part_type: RESISTORS\FIXED; Voltage: NA; Project: HMC; Customs_HS_Code: 85332119; Custom_Duty: 15%; Value: 1K_1%; PCB Footprint: RES0201_0-5; Footprint Path: Y:\MIS_DATABASE\Library\ALTIUM_TOOL\PCB_FOOTPRINTS\Altium_Footprint_Lib.PcbLib; Library Path: Y:\MIS_DATABASE\Library\ALTIUM_TOOL\SCHEMATICS_PARTS\MS_DISCRETE_Library.schlib; MECHANICAL 3D STEP FILE: RES0201_0-5; Footprint Ref: RES0201_0-5; Mfr_name: KOA SPEER; Tolerance: 1%; Wattage: 1/20W; Package: 0201; Distributor_name: MOUSER; Distributor_part_number: 660-RK73H1HTTC1001F; Height: 0.26MM; Weight: 0.17mg; Temperature: -55°C+155°C; Datasheet: Y:\MIS_DATABASE\DATASHEETS\RESISTORS\RK73H-SER.PDF; Crtd /date: MAZHAR/100511; Chkd/date: RAGESH/120511; Library Ref: RESISTOR
R407 = RESISTOR_Dup1: RES 1K 1/20W 1% 0201; Part Reference: R407; Manufacturer: KOA SPEER; Mistral Part No: 110015080014-R; Mfr_part_number: RK73H1HTTC1001F; Part_type: RESISTORS\FIXED; Voltage: NA; Project: HMC; Customs_HS_Code: 85332119; Custom_Duty: 15%; Value: 1K_1%; Footprint Path: Y:\MIS_DATABASE\Library\ALTIUM_TOOL\PCB_FOOTPRINTS\Altium_Footprint_Lib.PcbLib; Library Path: Y:\MIS_DATABASE\Library\ALTIUM_TOOL\SCHEMATICS_PARTS\MS_DISCRETE_Library.schlib; MECHANICAL 3D STEP FILE: RES0201_0-5; Footprint Ref: RES0201_0-5; Mfr_name: KOA SPEER; Tolerance: 1%; Wattage: 1/20W; Package: 0201; Distributor_name: MOUSER; Distributor_part_number: 660-RK73H1HTTC1001F; Height: 0.26MM; Weight: 0.17mg; Temperature: -55°C+155°C; Datasheet: Y:\MIS_DATABASE\DATASHEETS\RESISTORS\RK73H-SER.PDF; Crtd /date: MAZHAR/100511; Chkd/date: RAGESH/120511; Library Ref: RESISTOR; PCB Footprint: RES0201_0-5
R408 = RESISTOR_Dup2: RES 10K 1/20W 1% 0201; Part Reference: R408; Manufacturer: SAMSUNG; Part_type: RESISTORS\FIXED; Mfr_part_number: RC0603F103CS; Mistral Part No: 110011040018-R; Custom_Duty: 15%; Customs_HS_Code: 85332119; Voltage: NA; Project: BRUKER_SD820_COMMONDO; Value: 10K_1%; Footprint Path: Y:\MIS_DATABASE\Library\ALTIUM_TOOL\PCB_FOOTPRINTS\Altium_Footprint_Lib.PcbLib; Library Path: Y:\MIS_DATABASE\Library\ALTIUM_TOOL\SCHEMATICS_PARTS\MS_DISCRETE_Library.schlib; Footprint Ref: RES0201_0-5; Library Ref: RESISTOR; MECHANICAL 3D STEP FILE: RES0201_0-5; Chkd/date: MANIRAJA/080519; Crtd /date: ALVY/080519; Datasheet: Y:\MIS_DATABASE\DATASHEETS\RESISTORS\SAMSUNG_RC-SER.PDF; Temperature: -55°C+125°C; Weight: 0.15mg; Height: 0.26MM; Distributor_part_number: 1276-3670-1-ND; Distributor_name: DIGIKEY; Wattage: 1/20W; Tolerance: 1%; Mfr_name: SAMSUNG; PCB Footprint: RES0201_0-5
R410 = RESISTOR_Dup1: RES 1K 1/20W 1% 0201; Part Reference: R410; Manufacturer: KOA SPEER; Mistral Part No: 110015080014-R; Mfr_part_number: RK73H1HTTC1001F; Part_type: RESISTORS\FIXED; Voltage: NA; Project: HMC; Customs_HS_Code: 85332119; Custom_Duty: 15%; Value: 1K_1%; PCB Footprint: RES0201_0-5; Footprint Path: Y:\MIS_DATABASE\Library\ALTIUM_TOOL\PCB_FOOTPRINTS\Altium_Footprint_Lib.PcbLib; Library Path: Y:\MIS_DATABASE\Library\ALTIUM_TOOL\SCHEMATICS_PARTS\MS_DISCRETE_Library.schlib; MECHANICAL 3D STEP FILE: RES0201_0-5; Footprint Ref: RES0201_0-5; Mfr_name: KOA SPEER; Tolerance: 1%; Wattage: 1/20W; Package: 0201; Distributor_name: MOUSER; Distributor_part_number: 660-RK73H1HTTC1001F; Height: 0.26MM; Weight: 0.17mg; Temperature: -55°C+155°C; Datasheet: Y:\MIS_DATABASE\DATASHEETS\RESISTORS\RK73H-SER.PDF; Crtd /date: MAZHAR/100511; Chkd/date: RAGESH/120511; Library Ref: RESISTOR
R411 = RESISTOR_Dup1: RES 1K 1/20W 1% 0201; Part Reference: R411; Part_type: RESISTORS\FIXED; Mfr_part_number: RK73H1HTTC1001F; Mfr_name: KOA SPEER; Mistral Part No: 110015080014-R; Custom_Duty: 15%; Customs_HS_Code: 85332119; Project: HMC; Voltage: NA; Value: 1K_1%; Library Ref: RESISTOR; Chkd/date: RAGESH/120511; Crtd /date: MAZHAR/100511; Datasheet: Y:\MIS_DATABASE\DATASHEETS\RESISTORS\RK73H-SER.PDF; Temperature: -55°C+155°C; Weight: 0.17mg; Height: 0.26MM; Distributor_part_number: 660-RK73H1HTTC1001F; Distributor_name: MOUSER; Package: 0201; Wattage: 1/20W; Tolerance: 1%; Footprint Ref: RES0201_0-5; MECHANICAL 3D STEP FILE: RES0201_0-5; Library Path: Y:\MIS_DATABASE\Library\ALTIUM_TOOL\SCHEMATICS_PARTS\MS_DISCRETE_Library.schlib; Footprint Path: Y:\MIS_DATABASE\Library\ALTIUM_TOOL\PCB_FOOTPRINTS\Altium_Footprint_Lib.PcbLib; Manufacturer: KOA SPEER; PCB Footprint: RES0201_0-5
R413 = RESISTOR_Dup1: RES 1K 1/20W 1% 0201; Part Reference: R413; Manufacturer: KOA SPEER; Mistral Part No: 110015080014-R; Mfr_part_number: RK73H1HTTC1001F; Part_type: RESISTORS\FIXED; Voltage: NA; Project: HMC; Customs_HS_Code: 85332119; Custom_Duty: 15%; Value: 1K_1%; Footprint Path: Y:\MIS_DATABASE\Library\ALTIUM_TOOL\PCB_FOOTPRINTS\Altium_Footprint_Lib.PcbLib; Library Path: Y:\MIS_DATABASE\Library\ALTIUM_TOOL\SCHEMATICS_PARTS\MS_DISCRETE_Library.schlib; MECHANICAL 3D STEP FILE: RES0201_0-5; Footprint Ref: RES0201_0-5; Mfr_name: KOA SPEER; Tolerance: 1%; Wattage: 1/20W; Package: 0201; Distributor_name: MOUSER; Distributor_part_number: 660-RK73H1HTTC1001F; Height: 0.26MM; Weight: 0.17mg; Temperature: -55°C+155°C; Datasheet: Y:\MIS_DATABASE\DATASHEETS\RESISTORS\RK73H-SER.PDF; Crtd /date: MAZHAR/100511; Chkd/date: RAGESH/120511; Library Ref: RESISTOR; PCB Footprint: RES0201_0-5
R414 = RESISTOR_Dup2: RES 10K 1/20W 1% 0201; Part Reference: R414; Manufacturer: SAMSUNG; Part_type: RESISTORS\FIXED; Mfr_part_number: RC0603F103CS; Mistral Part No: 110011040018-R; Custom_Duty: 15%; Customs_HS_Code: 85332119; Voltage: NA; Project: BRUKER_SD820_COMMONDO; Value: 10K_1%; Footprint Path: Y:\MIS_DATABASE\Library\ALTIUM_TOOL\PCB_FOOTPRINTS\Altium_Footprint_Lib.PcbLib; Library Path: Y:\MIS_DATABASE\Library\ALTIUM_TOOL\SCHEMATICS_PARTS\MS_DISCRETE_Library.schlib; Footprint Ref: RES0201_0-5; Library Ref: RESISTOR; MECHANICAL 3D STEP FILE: RES0201_0-5; Chkd/date: MANIRAJA/080519; Crtd /date: ALVY/080519; Datasheet: Y:\MIS_DATABASE\DATASHEETS\RESISTORS\SAMSUNG_RC-SER.PDF; Temperature: -55°C+125°C; Weight: 0.15mg; Height: 0.26MM; Distributor_part_number: 1276-3670-1-ND; Distributor_name: DIGIKEY; Wattage: 1/20W; Tolerance: 1%; Mfr_name: SAMSUNG; PCB Footprint: RES0201_0-5
R416 = RESISTOR_Dup1: RES 1K 1/20W 1% 0201; Part Reference: R416; Part_type: RESISTORS\FIXED; Mfr_part_number: RK73H1HTTC1001F; Mfr_name: KOA SPEER; Mistral Part No: 110015080014-R; Custom_Duty: 15%; Customs_HS_Code: 85332119; Project: HMC; Voltage: NA; Value: 1K_1%; PCB Footprint: RES0201_0-5; Library Ref: RESISTOR; Chkd/date: RAGESH/120511; Crtd /date: MAZHAR/100511; Datasheet: Y:\MIS_DATABASE\DATASHEETS\RESISTORS\RK73H-SER.PDF; Temperature: -55°C+155°C; Weight: 0.17mg; Height: 0.26MM; Distributor_part_number: 660-RK73H1HTTC1001F; Distributor_name: MOUSER; Package: 0201; Wattage: 1/20W; Tolerance: 1%; Footprint Ref: RES0201_0-5; MECHANICAL 3D STEP FILE: RES0201_0-5; Library Path: Y:\MIS_DATABASE\Library\ALTIUM_TOOL\SCHEMATICS_PARTS\MS_DISCRETE_Library.schlib; Footprint Path: Y:\MIS_DATABASE\Library\ALTIUM_TOOL\PCB_FOOTPRINTS\Altium_Footprint_Lib.PcbLib; Manufacturer: KOA SPEER
R417 = RESISTOR_Dup2: RES 10K 1/20W 1% 0201; Part Reference: R417; Manufacturer: SAMSUNG; Part_type: RESISTORS\FIXED; Mfr_part_number: RC0603F103CS; Mistral Part No: 110011040018-R; Custom_Duty: 15%; Customs_HS_Code: 85332119; Voltage: NA; Project: BRUKER_SD820_COMMONDO; Value: 10K_1%; Footprint Path: Y:\MIS_DATABASE\Library\ALTIUM_TOOL\PCB_FOOTPRINTS\Altium_Footprint_Lib.PcbLib; Library Path: Y:\MIS_DATABASE\Library\ALTIUM_TOOL\SCHEMATICS_PARTS\MS_DISCRETE_Library.schlib; Footprint Ref: RES0201_0-5; Library Ref: RESISTOR; MECHANICAL 3D STEP FILE: RES0201_0-5; Chkd/date: MANIRAJA/080519; Crtd /date: ALVY/080519; Datasheet: Y:\MIS_DATABASE\DATASHEETS\RESISTORS\SAMSUNG_RC-SER.PDF; Temperature: -55°C+125°C; Weight: 0.15mg; Height: 0.26MM; Distributor_part_number: 1276-3670-1-ND; Distributor_name: DIGIKEY; Wattage: 1/20W; Tolerance: 1%; Mfr_name: SAMSUNG; PCB Footprint: RES0201_0-5
R419 = RESISTOR_Dup1: RES 1K 1/20W 1% 0201; Part Reference: R419; Manufacturer: KOA SPEER; Mistral Part No: 110015080014-R; Mfr_part_number: RK73H1HTTC1001F; Part_type: RESISTORS\FIXED; Voltage: NA; Project: HMC; Customs_HS_Code: 85332119; Custom_Duty: 15%; Value: 1K_1%; Footprint Path: Y:\MIS_DATABASE\Library\ALTIUM_TOOL\PCB_FOOTPRINTS\Altium_Footprint_Lib.PcbLib; Library Path: Y:\MIS_DATABASE\Library\ALTIUM_TOOL\SCHEMATICS_PARTS\MS_DISCRETE_Library.schlib; MECHANICAL 3D STEP FILE: RES0201_0-5; Footprint Ref: RES0201_0-5; Mfr_name: KOA SPEER; Tolerance: 1%; Wattage: 1/20W; Package: 0201; Distributor_name: MOUSER; Distributor_part_number: 660-RK73H1HTTC1001F; Height: 0.26MM; Weight: 0.17mg; Temperature: -55°C+155°C; Datasheet: Y:\MIS_DATABASE\DATASHEETS\RESISTORS\RK73H-SER.PDF; Crtd /date: MAZHAR/100511; Chkd/date: RAGESH/120511; Library Ref: RESISTOR; PCB Footprint: RES0201_0-5
R423 = RESISTOR_Dup2: RES 10K 1/16W 1% 0402; Part Reference: R423; Manufacturer: YAGEO AMERICA; Mistral Part No: 110015090015-R; Mfr_part_number: RC0402FR-0710KL; Part_type: RESISTORS\FIXED; Project: VOCERA; Voltage: NA; Customs_HS_Code: 85332119; Custom_Duty: 15%; Value: 10K_1%; PCB Footprint: RES0402_0-5; Footprint Ref: RES0402_0-5; Mfr_name: YAGEO AMERICA; Tolerance: 1%; Wattage: 1/16W; Package: 0402; Distributor_name: DIGIKEY; Distributor_part_number: 311-10.0KLRTR-ND; Library Ref: RESISTOR; Height: 0.40MM; Weight: 0.65mg; Temperature: -55°C+155°C; Datasheet: Y:\MIS_DATABASE\DATASHEETS\RESISTORS\RCXXXXL-SER_MAR18.PDF; Crtd /date: GEETHA/290506; Chkd/date: VASANTHA/201216; MECHANICAL 3D STEP FILE: RES0402_0-5; Library Path: Y:\MIS_DATABASE\Library\ALTIUM_TOOL\SCHEMATICS_PARTS\MS_DISCRETE_Library.schlib; Footprint Path: Y:\MIS_DATABASE\Library\ALTIUM_TOOL\PCB_FOOTPRINTS\Altium_Footprint_Lib.PcbLib
R446 = RESISTOR_Dup1: RES 1K 1/20W 1% 0201; Part Reference: R446; Manufacturer: KOA SPEER; Mistral Part No: 110015080014-R; Mfr_part_number: RK73H1HTTC1001F; Part_type: RESISTORS\FIXED; Voltage: NA; Project: HMC; Customs_HS_Code: 85332119; Custom_Duty: 15%; Value: 1K_1%; Footprint Path: Y:\MIS_DATABASE\Library\ALTIUM_TOOL\PCB_FOOTPRINTS\Altium_Footprint_Lib.PcbLib; Library Path: Y:\MIS_DATABASE\Library\ALTIUM_TOOL\SCHEMATICS_PARTS\MS_DISCRETE_Library.schlib; MECHANICAL 3D STEP FILE: RES0201_0-5; Footprint Ref: RES0201_0-5; Mfr_name: KOA SPEER; Tolerance: 1%; Wattage: 1/20W; Package: 0201; Distributor_name: MOUSER; Distributor_part_number: 660-RK73H1HTTC1001F; Height: 0.26MM; Weight: 0.17mg; Temperature: -55°C+155°C; Datasheet: Y:\MIS_DATABASE\DATASHEETS\RESISTORS\RK73H-SER.PDF; Crtd /date: MAZHAR/100511; Chkd/date: RAGESH/120511; Library Ref: RESISTOR; PCB Footprint: RES0201_0-5
R475 = RESISTOR_Dup2: RES 10K 1/16W 1% 0402; Part Reference: R475; Manufacturer: YAGEO AMERICA; Mistral Part No: 110015090015-R; Mfr_part_number: RC0402FR-0710KL; Part_type: RESISTORS\FIXED; Project: VOCERA; Voltage: NA; Customs_HS_Code: 85332119; Custom_Duty: 15%; Value: 10K_1%; PCB Footprint: RES0402_0-5; Footprint Ref: RES0402_0-5; Mfr_name: YAGEO AMERICA; Tolerance: 1%; Wattage: 1/16W; Distributor_name: DIGIKEY; Distributor_part_number: 311-10.0KLRTR-ND; Library Ref: RESISTOR; Height: 0.40MM; Weight: 0.65mg; Temperature: -55°C+155°C; Datasheet: Y:\MIS_DATABASE\DATASHEETS\RESISTORS\RCXXXXL-SER_MAR18.PDF; Crtd /date: GEETHA/290506; Chkd/date: VASANTHA/201216; MECHANICAL 3D STEP FILE: RES0402_0-5; Library Path: Y:\MIS_DATABASE\Library\ALTIUM_TOOL\SCHEMATICS_PARTS\MS_DISCRETE_Library.schlib; Footprint Path: Y:\MIS_DATABASE\Library\ALTIUM_TOOL\PCB_FOOTPRINTS\Altium_Footprint_Lib.PcbLib
R476 = RESISTOR_Dup2: RES 10K 1/16W 1% 0402; Part Reference: R476; Manufacturer: YAGEO AMERICA; Part_type: RESISTORS\FIXED; Mfr_part_number: RC0402FR-0710KL; Mistral Part No: 110015090015-R; Custom_Duty: 15%; Customs_HS_Code: 85332119; Voltage: NA; Project: VOCERA; Value: 10K_1%; PCB Footprint: RES0402_0-5; Footprint Path: Y:\MIS_DATABASE\Library\ALTIUM_TOOL\PCB_FOOTPRINTS\Altium_Footprint_Lib.PcbLib; Library Path: Y:\MIS_DATABASE\Library\ALTIUM_TOOL\SCHEMATICS_PARTS\MS_DISCRETE_Library.schlib; MECHANICAL 3D STEP FILE: RES0402_0-5; Chkd/date: VASANTHA/201216; Crtd /date: GEETHA/290506; Datasheet: Y:\MIS_DATABASE\DATASHEETS\RESISTORS\RCXXXXL-SER_MAR18.PDF; Temperature: -55°C+155°C; Weight: 0.65mg; Height: 0.40MM; Library Ref: RESISTOR; Distributor_part_number: 311-10.0KLRTR-ND; Distributor_name: DIGIKEY; Wattage: 1/16W; Tolerance: 1%; Mfr_name: YAGEO AMERICA; Footprint Ref: RES0402_0-5
R508 = RESISTOR_Dup2: RES 2.2K 1/20W 5% 0201; Part Reference: R508; Part_type: RESISTORS\FIXED; Mfr_part_number: RC0201JR-072K2L; Mfr_name: YAGEO AMERICA; Mistral Part No: 110009030427-R; Custom_Duty: 15%; Customs_HS_Code: 85332119; Voltage: NA; Project: GOLDEN-I LITE; Value: 2.2K; PCB Footprint: RES0201_0-5; MECHANICAL 3D STEP FILE: RES0201_0-5; Chkd/date: MANIRAJA/050517; Crtd /date: MANIRAJA/050517; Datasheet: Y:\MIS_DATABASE\DATASHEETS\RESISTORS\RCXXXXL-SER_MAR18.PDF; Temperature: -55°C+125°C; Weight: 0.17mg; Height: 0.26MM; Library Ref: RESISTOR; Distributor_part_number: 311-2.2KNCT-ND; Distributor_name: DIGIKEY; Wattage: 1/20W; Tolerance: 5%; Footprint Ref: RES0201_0-5; Library Path: Y:\MIS_DATABASE\Library\ALTIUM_TOOL\SCHEMATICS_PARTS\MS_DISCRETE_Library.schlib; Footprint Path: Y:\MIS_DATABASE\Library\ALTIUM_TOOL\PCB_FOOTPRINTS\Altium_Footprint_Lib.PcbLib; Manufacturer: YAGEO AMERICA
R509 = RESISTOR_Dup2: RES 2.2K 1/20W 5% 0201; Part Reference: R509; Manufacturer: YAGEO AMERICA; Mistral Part No: 110009030427-R; Mfr_part_number: RC0201JR-072K2L; Part_type: RESISTORS\FIXED; Project: GOLDEN-I LITE; Voltage: NA; Customs_HS_Code: 85332119; Custom_Duty: 15%; Value: 2.2K; PCB Footprint: RES0201_0-5; Footprint Path: Y:\MIS_DATABASE\Library\ALTIUM_TOOL\PCB_FOOTPRINTS\Altium_Footprint_Lib.PcbLib; Library Path: Y:\MIS_DATABASE\Library\ALTIUM_TOOL\SCHEMATICS_PARTS\MS_DISCRETE_Library.schlib; Footprint Ref: RES0201_0-5; Mfr_name: YAGEO AMERICA; Tolerance: 5%; Wattage: 1/20W; Distributor_name: DIGIKEY; Distributor_part_number: 311-2.2KNCT-ND; Library Ref: RESISTOR; Height: 0.26MM; Weight: 0.17mg; Temperature: -55°C+125°C; Datasheet: Y:\MIS_DATABASE\DATASHEETS\RESISTORS\RCXXXXL-SER_MAR18.PDF; Crtd /date: MANIRAJA/050517; Chkd/date: MANIRAJA/050517; MECHANICAL 3D STEP FILE: RES0201_0-5
TP47 = TESTPOINT: TESTPOINT CIR 30 SMD; Part Reference: TP47; Mfr_name: LOCAL; Mistral Part No: 130009030930; Part #: SMT-TP030; MECHANICAL 3D STEP FILE: NA; Project: BT MODULE_CSRBC04; ASSEMBLY: DNP; Value: TP30_SMD; PCB Footprint: TP30_SMD; Footprint Path: Y:\MIS_DATABASE\Library\ALTIUM_TOOL\PCB_FOOTPRINTS\Altium_Footprint_Lib.PcbLib; Library Path: Y:\MIS_DATABASE\Library\ALTIUM_TOOL\SCHEMATICS_PARTS\MS_DISCRETE_Library.schlib; Custom_Duty: NA; Customs_HS_Code: NA; RoHS: NA; Chkd/date: SHREESHAIL/171006; Crtd /date: MAZHAR/171006; Datasheet: NA; Temperature: NA; Weight: NA; Height: NA; Library Ref: TESTPOINT; Distributor_part_number: NA; Distributor_name: NA; Package: SMD; Wattage: NA; Voltage: NA; Tolerance: NA; Part_type: TESTPOINT; Mfr_part_number: TP30_SMD; Footprint Ref: TP30_SMD; MANUFACTURER: LOCAL
TP51 = TESTPOINT: TESTPOINT CIR 30 SMD; Part Reference: TP51; Mfr_name: LOCAL; Mistral Part No: 130009030930; Part #: SMT-TP030; MECHANICAL 3D STEP FILE: NA; Project: BT MODULE_CSRBC04; ASSEMBLY: DNP; Value: TP30_SMD; PCB Footprint: TP30_SMD; Footprint Path: Y:\MIS_DATABASE\Library\ALTIUM_TOOL\PCB_FOOTPRINTS\Altium_Footprint_Lib.PcbLib; Library Path: Y:\MIS_DATABASE\Library\ALTIUM_TOOL\SCHEMATICS_PARTS\MS_DISCRETE_Library.schlib; Custom_Duty: NA; Customs_HS_Code: NA; RoHS: NA; Chkd/date: SHREESHAIL/171006; Crtd /date: MAZHAR/171006; Datasheet: NA; Temperature: NA; Weight: NA; Height: NA; Library Ref: TESTPOINT; Distributor_part_number: NA; Distributor_name: NA; Package: SMD; Wattage: NA; Voltage: NA; Tolerance: NA; Part_type: TESTPOINT; Mfr_part_number: TP30_SMD; Footprint Ref: TP30_SMD; MANUFACTURER: LOCAL
TP52 = TESTPOINT_Dup1: TESTPOINT CIR 30 SMD; Part Reference: TP52; Mistral Part No: 130009030930; Mfr_name: LOCAL; Project: BT MODULE_CSRBC04; Tolerance: NA; Value: TP30_SMD; PCB Footprint: TP30_SMD; Footprint Ref: TP30_SMD; Mfr_part_number: TP30_SMD; Part_type: TESTPOINT; Voltage: NA; Wattage: NA; Package: SMD; Distributor_name: NA; Distributor_part_number: NA; Library Ref: TESTPOINT; Height: NA; Weight: NA; Temperature: NA; Datasheet: NA; Crtd /date: MAZHAR/171006; Chkd/date: SHREESHAIL/171006; RoHS: NA; Customs_HS_Code: NA; Custom_Duty: NA; MECHANICAL 3D STEP FILE: NA; Library Path: Y:\MIS_DATABASE\Library\ALTIUM_TOOL\SCHEMATICS_PARTS\MS_DISCRETE_Library.schlib; Footprint Path: Y:\MIS_DATABASE\Library\ALTIUM_TOOL\PCB_FOOTPRINTS\Altium_Footprint_Lib.PcbLib; Manufacturer: LOCAL
TP71 = TESTPOINT: TESTPOINT CIR 30 SMD; Part Reference: TP71; MANUFACTURER: LOCAL; Part #: SMT-TP030; Mistral Part No: 130009030930; ASSEMBLY: DNP; Project: BT MODULE_CSRBC04; Tolerance: NA; Value: TP30_SMD; PCB Footprint: TP30_SMD; Footprint Ref: TP30_SMD; Mfr_name: LOCAL; Mfr_part_number: TP30_SMD; Part_type: TESTPOINT; Voltage: NA; Wattage: NA; Package: SMD; Distributor_name: NA; Distributor_part_number: NA; Library Ref: TESTPOINT; Height: NA; Weight: NA; Temperature: NA; Datasheet: NA; Crtd /date: MAZHAR/171006; Chkd/date: SHREESHAIL/171006; RoHS: NA; Customs_HS_Code: NA; Custom_Duty: NA; MECHANICAL 3D STEP FILE: NA; Library Path: Y:\MIS_DATABASE\Library\ALTIUM_TOOL\SCHEMATICS_PARTS\MS_DISCRETE_Library.schlib; Footprint Path: Y:\MIS_DATABASE\Library\ALTIUM_TOOL\PCB_FOOTPRINTS\Altium_Footprint_Lib.PcbLib
TP101 = TESTPOINT: TESTPOINT CIR 30 SMD; Part Reference: TP101; MANUFACTURER: LOCAL; Part #: SMT-TP030; Mistral Part No: 130009030930; ASSEMBLY: DNP; Project: BT MODULE_CSRBC04; Tolerance: NA; Value: TP30_SMD; PCB Footprint: TP30_SMD; Footprint Ref: TP30_SMD; Mfr_name: LOCAL; Mfr_part_number: TP30_SMD; Part_type: TESTPOINT; Voltage: NA; Wattage: NA; Package: SMD; Distributor_name: NA; Distributor_part_number: NA; Library Ref: TESTPOINT; Height: NA; Weight: NA; Temperature: NA; Datasheet: NA; Crtd /date: MAZHAR/171006; Chkd/date: SHREESHAIL/171006; RoHS: NA; Customs_HS_Code: NA; Custom_Duty: NA; MECHANICAL 3D STEP FILE: NA; Library Path: Y:\MIS_DATABASE\Library\ALTIUM_TOOL\SCHEMATICS_PARTS\MS_DISCRETE_Library.schlib; Footprint Path: Y:\MIS_DATABASE\Library\ALTIUM_TOOL\PCB_FOOTPRINTS\Altium_Footprint_Lib.PcbLib
U28 = J7AHPSoC-EVM_BGA1414: IC AM69 SoC EVM MICROPROCESSOR BGA1414; Part Reference: U28; Mistral Part No: 141230020002; Mfr_name: TEXAS INSTRUMENTS; Part_type: ICS\DIGITAL\MICROPROCESSOR; SPLIT_INST: TRUE; SWAP_INFO: (S1+S2+S3+S4+S5+S6+S7+S8+S9+S10+S11+S12+S13+S14+S15+S16+S17+S18+S19+S20+S21+S22+S23+S24+S25+S26); Project: TI_J7AHP SK_BRD; Tolerance: NA; Customs_HS_Code: 85423100; Custom_Duty: 15%; Value: XJ784S45AALY; Footprint Ref: BGA1414_31-49_1230X1230_2-7; Mfr_part_number: XJ784S45AALY; Voltage: NA; Wattage: NA; Package: BGA1414; Distributor_name: NA; Distributor_part_number: NA; Library Ref: J7AHPSoC-EVM_BGA1414; Height: 2.70MM; Weight: NA; Temperature: NA; Datasheet: Y:\MIS_DATABASE\DATASHEETS\ICS\DIGITAL\MICROCONTROLLER\J7AHP-SoC-EVM.PDF; Crtd /date: ALVY/141221; Chkd/date: MANIRAJA/151221; RoHS: NA; MECHANICAL 3D STEP FILE: BGA1414_31-49_1230X1230_2-7; Library Path: Y:\MIS_DATABASE\Library\ALTIUM_TOOL\SCHEMATICS_PARTS\MS_MICROPROCESSOR_Library.schlib; Footprint Path: Y:\MIS_DATABASE\Library\ALTIUM_TOOL\PCB_FOOTPRINTS\Altium_Footprint_Lib.PcbLib; Manufacturer: TEXAS INSTRUMENTS; PCB Footprint: BGA1414_31-49_1230X1230_2-7
Y2 = CRY4_ABM8G: CRY 19.200MHz 8pF SMD; Part Reference: Y2; Manufacturer: ABRACON CORPORATION; Mistral Part No: 130019010009-R; Part_type: CRYSTAL; Project: TI_J7_SVB-DUT; Tolerance: NA; Customs_HS_Code: 85439000; Custom_Duty: 24%; Value: 19.200MHz; Footprint Ref: XTAL4_ABM10W_100X80_SMD_0-6; Mfr_name: ABRACON CORPORATION; Voltage: NA; Wattage: NA; Package: SMD; Distributor_name: DIGIKEY; Distributor_part_number: ABM10W-19.2000MHZ-8-K1Z-T3-ND; Library Ref: CRY4_ABM8G; Height: 0.60MM; Weight: NA; Temperature: -40°C+125°C; Datasheet: Y:\MIS_DATABASE\DATASHEETS\MISC\CRY_OSC\ABM10W.PDF; Crtd /date: ALVY/250119; Chkd/date: MANIRAJA/250119; MECHANICAL 3D STEP FILE: XTAL4_ABM10W_100X80_SMD_0-6; Library Path: Y:\MIS_DATABASE\Library\ALTIUM_TOOL\SCHEMATICS_PARTS\MS_DISCRETE_Library.schlib; Footprint Path: Y:\MIS_DATABASE\Library\ALTIUM_TOOL\PCB_FOOTPRINTS\Altium_Footprint_Lib.PcbLib; PCB Footprint: XTAL4_ABM10W_100X80_SMD_0-6
Y3 = CRY4_ABM8G: CRY 26.000MHz 8pF SMD; Part Reference: Y3; Manufacturer: ABRACON CORPORATION; Part_type: CRYSTAL; Mistral Part No: 130021040032-R; Custom_Duty: 24%; Customs_HS_Code: 85439000; Wattage: NA; Project: TI_J7AEP_EVM_SOM; Value: 26.000MHz; Footprint Path: Y:\MIS_DATABASE\Library\ALTIUM_TOOL\PCB_FOOTPRINTS\Altium_Footprint_Lib.PcbLib; Library Path: Y:\MIS_DATABASE\Library\ALTIUM_TOOL\SCHEMATICS_PARTS\MS_DISCRETE_Library.schlib; MECHANICAL 3D STEP FILE: XTAL4_ABM10W_100X80_SMD_0-6; Chkd/date: ALVY/160421; Crtd /date: MANIRAJA/160421; Datasheet: Y:\MIS_DATABASE\DATASHEETS\MISC\CRY_OSC\ABM10W_JUN20.PDF; Temperature: -40°C+125°C; Weight: NA; Height: 0.60MM; Library Ref: CRY4_ABM8G; Distributor_part_number: ABM10W-26.0000MHZ-8-K1Z-T3-ND; Distributor_name: DIGIKEY; Package: SMD; Voltage: NA; Tolerance: NA; Mfr_name: ABRACON CORPORATION; Footprint Ref: XTAL4_ABM10W_100X80_SMD_0-6; PCB Footprint: XTAL4_ABM10W_100X80_SMD_0-6